# EAGLE schematic Control (EAGLE 6.6.0)
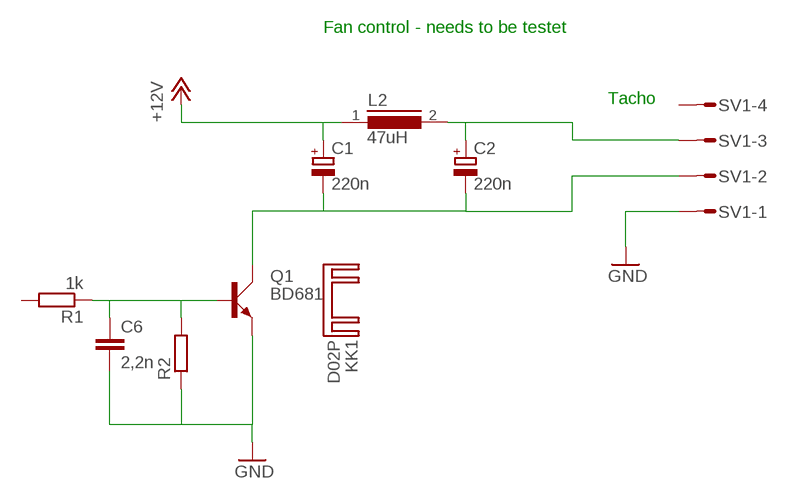
[diagram p0: schematic, sheet 1]

## Parts
C1  220n  CPOL-EUE3.5-10  [E3,5-10]
C2  220n  CPOL-EUE3.5-10  [E3,5-10]
C6  2,2n  C-EUC1206  [C1206]
KK1  D02P  [D02PA]
L2  47uH  DR125  [DR125]
Q1  BD681  BD437  [TO126AV]
R1  1k  R-EU_M1206  [M1206]
R2  R-EU_M1206  [M1206]
SV1  S04P  [S04P]

## Nets
+12V: C1.+ L2.1
GND: C6.2 Q1.E R2.1 SV1.1
N$1: C6.1 Q1.B R1.1 R2.2
N$2: C1.- C2.- Q1.C SV1.2
N$3: C2.+ L2.2 SV1.3
Unconnected: R1.2 SV1.4

## Notes on the sheet
- Fan control - needs to be testet
- Tacho

## Library data of the parts
C1 C2 = resistor:CPOL-EU: POLARIZED CAPACITOR, European symbol
C6 = resistor:C-EU: CAPACITOR, European symbol
KK1 = heatsink:D02P: HEATSINK distributor Schukat
L2 = inductors:DR125: High Power Density, High Efficiency, Shielded Inductors Source: coiltronics_dr_series.pdf
Q1 = transistor-power:BD437: NPN TRANSISTOR
R1 R2 = resistor:R-EU_: RESISTOR, European symbol
SV1 = con-amp-mt:S04P: AMP MT CONNECTOR; OC_FARNELL: unknown; OC_NEWARK: unknown